# EAGLE design m1k_analog_mux-4052 (EAGLE 7.7.0)
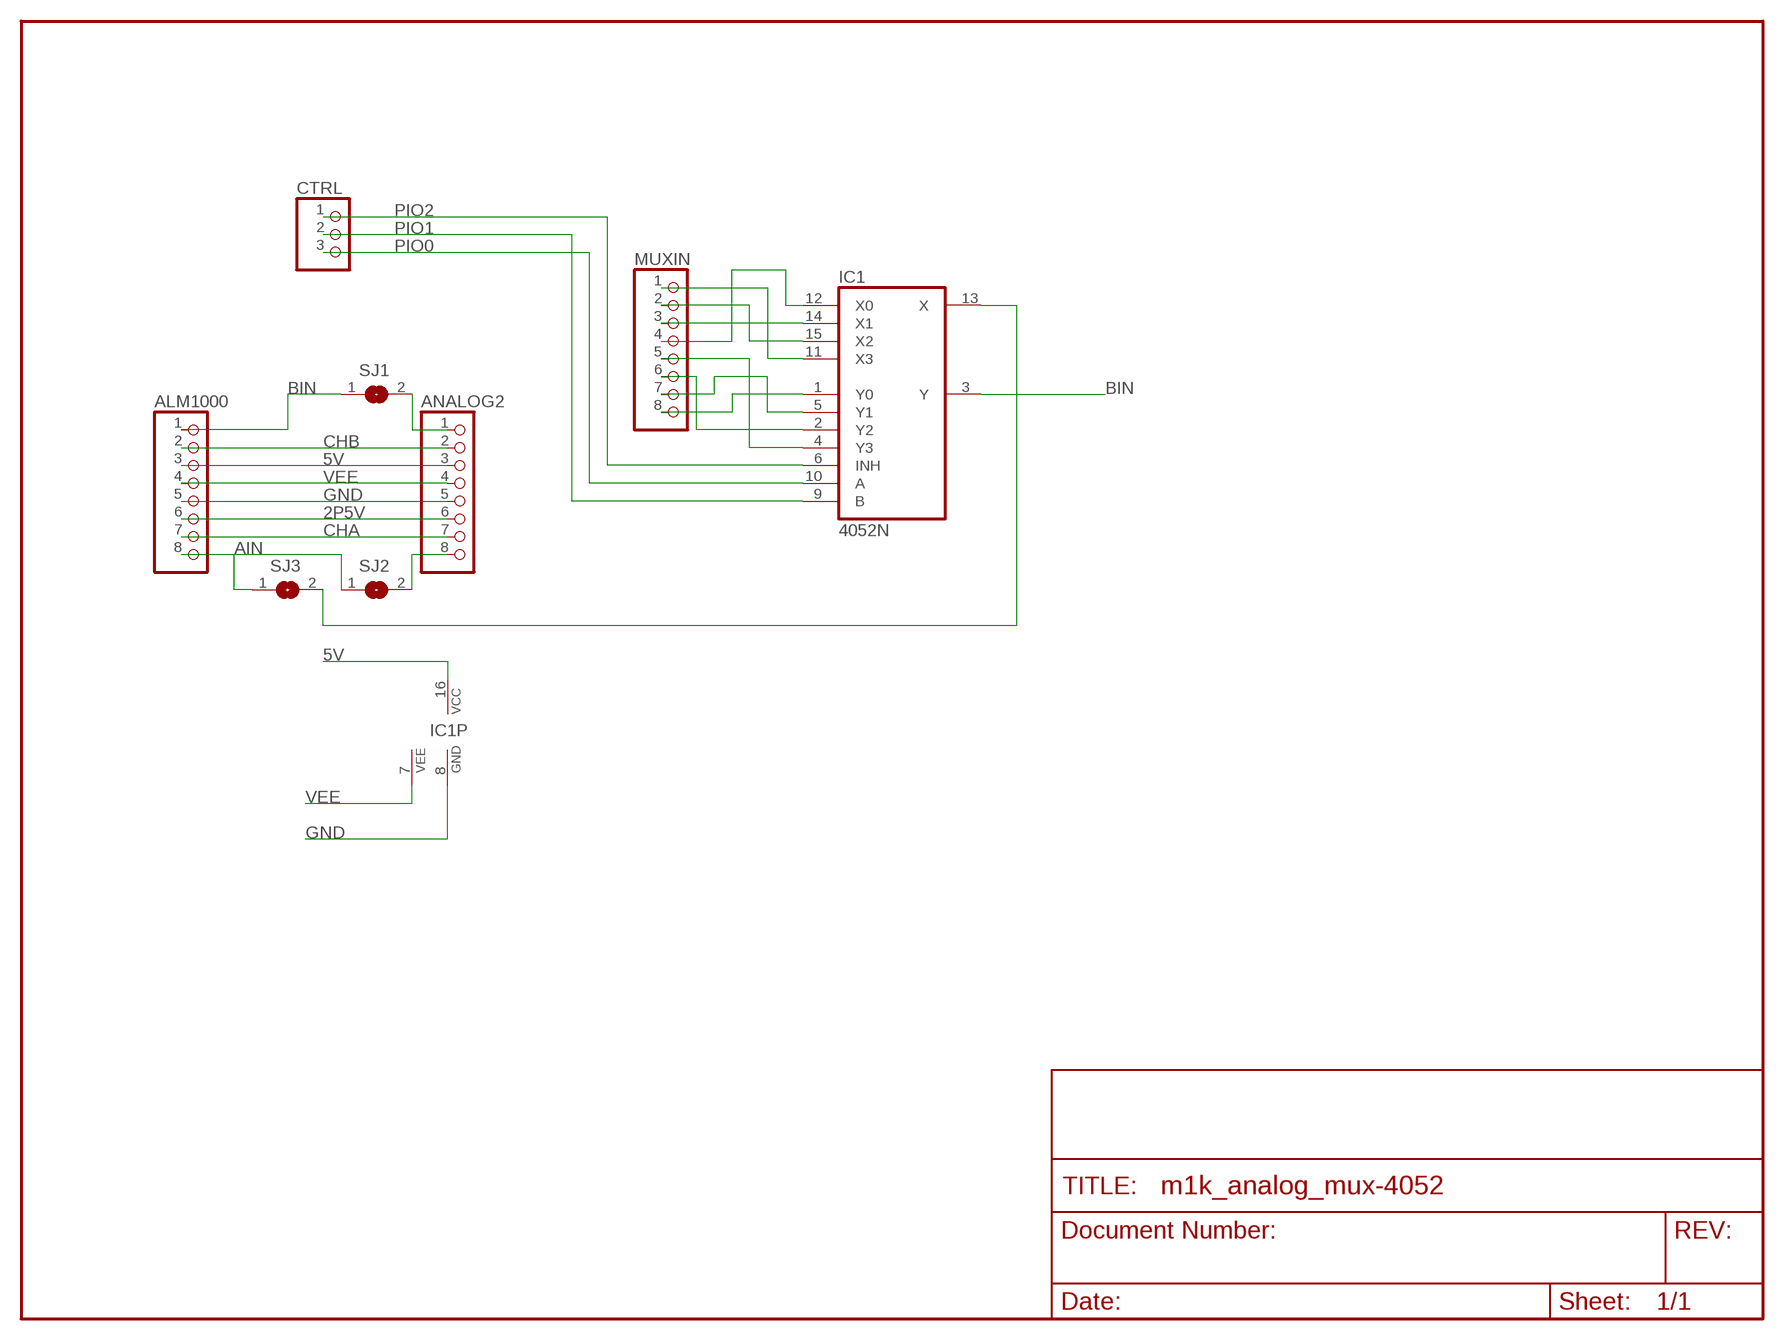
[diagram p0: schematic, sheet 1]

## Parts
ALM1000  PINHD-1X8  [1X08]
ANALOG2  PINHD-1X8  [1X08]
CTRL  PINHD-1X3  [1X03]
IC1  4052N  [DIL16]
MUXIN  PINHD-1X8  [1X08]
SJ1  SJ  [SJ]
SJ2  SJ  [SJ]
SJ3  SJ  [SJ]

## Nets
2P5V: ALM1000.6 ANALOG2.6
5V: ALM1000.3 ANALOG2.3 IC1.16(VCC)
AIN: ALM1000.8 SJ2.1 SJ3.1
BIN: ALM1000.1 IC1.3(Y) SJ1.1
CHA: ALM1000.7 ANALOG2.7
CHB: ALM1000.2 ANALOG2.2
GND: ALM1000.5 ANALOG2.5 IC1.8(GND)
N$1: IC1.1(Y0) MUXIN.8
N$2: ANALOG2.1 SJ1.2
N$3: IC1.5(Y1) MUXIN.7
N$4: IC1.2(Y2) MUXIN.6
N$5: IC1.4(Y3) MUXIN.5
N$6: IC1.11(X3) MUXIN.1
N$7: IC1.15(X2) MUXIN.2
N$8: IC1.14(X1) MUXIN.3
N$9: IC1.12(X0) MUXIN.4
N$10: ANALOG2.8 SJ2.2
N$11: IC1.13(X) SJ3.2
PIO0: CTRL.3 IC1.10(A)
PIO1: CTRL.2 IC1.9(B)
PIO2: CTRL.1 IC1.6(INH)
VEE: ALM1000.4 ANALOG2.4 IC1.7(VEE)

## Library data of the parts
ALM1000 ANALOG2 MUXIN = pinhead:PINHD-1X8: PIN HEADER
CTRL = pinhead:PINHD-1X3: PIN HEADER
IC1 = 40xx:4052: Dual 4-channel ANALOG MULTIPLEXER
SJ1-SJ3 = jumper:SJ: SMD solder JUMPER

## Board
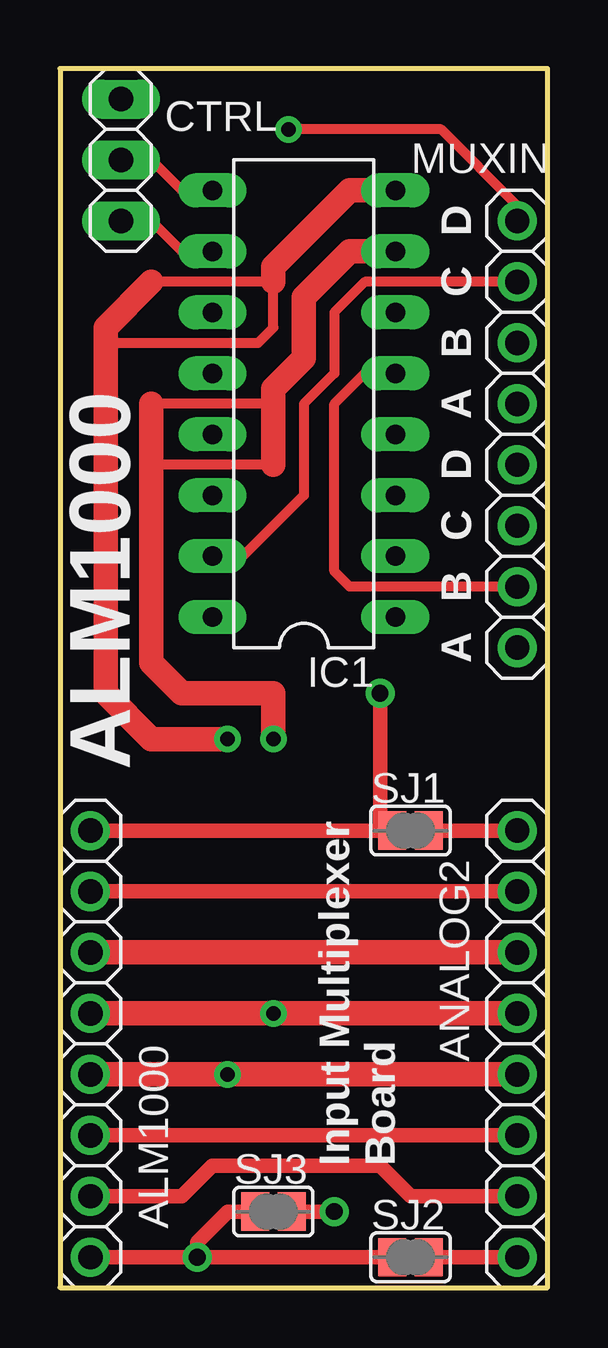
[diagram p1: board, top side]
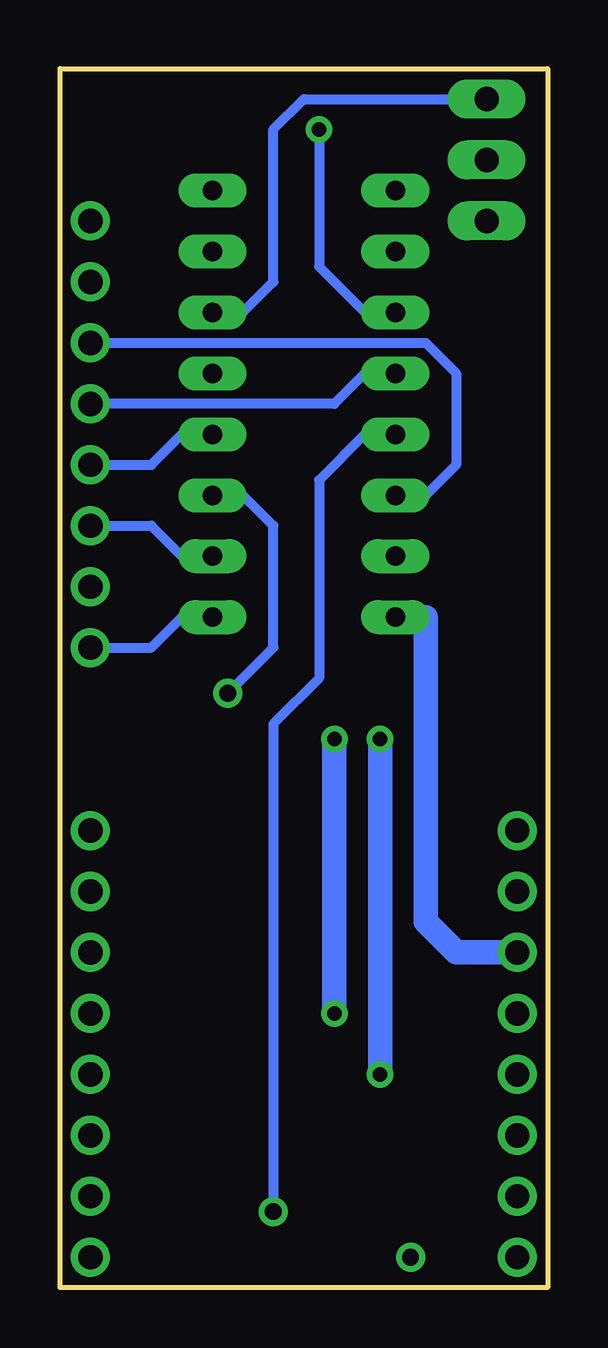
[diagram p2: board, bottom side, seen from below]

Size 20.32 x 50.8 mm. Coordinates in mm from the lower left corner, seen from the top.
Outline: 20.32,0 20.32,50.8 0,50.8 0,0 20.32,0
Copper layers (1*16): Top 0.035mm / dielectric 1.5mm / Bottom 0.035mm
Design rules "default": minimum track width 8mil, minimum drill 20mil, track to track 8mil, track to pad 8mil, pad to pad 8mil, via to via 8mil, smd to smd 8mil, copper to edge 8mil, drill to drill 8mil, minimum pad ring 12mil, minimum via ring 10mil, stop-mask expansion 4mil, vias tented up to drill 20mil, thermal gap 10mil

### Footprints (pad centres in the part's own frame; a part is rotated, then mirrored left to right if it is on the bottom)
1X08 = drill 1.016: 1 -8.89,0; 2 -6.35,0; 3 -3.81,0; 4 -1.27,0; 5 1.27,0; 6 3.81,0; 7 6.35,0; 8 8.89,0
1X03 = drill 1.016 long: 1 -2.54,0; 2 0,0; 3 2.54,0
DIL16 = drill 0.813 long: 1 -8.89,-3.81; 2 -6.35,-3.81; 3 -3.81,-3.81; 4 -1.27,-3.81; 5 1.27,-3.81; 6 3.81,-3.81; 7 6.35,-3.81; 8 8.89,-3.81; 9 8.89,3.81; 10 6.35,3.81; 11 3.81,3.81; 12 1.27,3.81; 13 -1.27,3.81; 14 -3.81,3.81; 15 -6.35,3.81; 16 -8.89,3.81
SJ = smd 1.168 x 1.6: 1 -0.762,0; 2 0.762,0

### Placement (x,y rotation side)
ALM1000  1.27,10.16 270 top
ANALOG2  19.05,10.16 270 top
CTRL  2.54,46.99 270 top
IC1  10.16,36.83 90 top
MUXIN  19.05,35.56 270 top
SJ1  14.61,19.05 0 top
SJ2  14.61,1.27 0 top
SJ3  8.89,3.17 0 top

### Tracks (layer width: path | path; a pad name or v marks a point on that pad's centre or on a via)
2P5V
  Top 0.61: ALM1000.6 ANALOG2.6
5V
  Top 1.016: ALM1000.3 ANALOG2.3
  Bottom 1.016: IC1.16 5.08,27.94 5.08,15.24 3.81,13.97 ALM1000.3
AIN  (via drill 0.7)
  Top 0.61: ALM1000.8 v5.71,1.27 | v5.71,1.27 5.71,1.91 6.99,3.17 SJ3.1 | SJ2.1 v5.71,1.27
BIN  (via drill 0.7)
  Top 0.61: ALM1000.1 13.34,19.05 | 13.34,19.05 SJ1.1 | v13.34,24.77 13.34,19.05
  Bottom 0.406: v13.34,24.77 11.43,26.67 11.43,31.75 12.7,33.02 IC1.3
CHA
  Top 0.61: ALM1000.7 5.08,3.81 6.35,5.08 13.34,5.08 14.61,3.81 ANALOG2.7
CHB
  Top 0.61: ALM1000.2 ANALOG2.2
GND  (via drill 0.6)
  Top 0.406: 3.81,41.91 8.89,41.91 8.89,40.01 8.26,39.37 1.91,39.37
  Top 1.016: IC1.8 12.06,45.72 8.89,42.55 8.89,41.91 | 3.81,41.91 1.91,40.01 1.91,39.37 1.91,24.77 3.81,22.86 v6.99,22.86 | v6.99,8.89 ALM1000.5 ANALOG2.5
  Bottom 1.016: v6.99,22.86 v6.99,8.89
N$1
  Bottom 0.406: MUXIN.8 16.51,26.67 15.24,27.94 IC1.1
N$2
  Top 0.61: ANALOG2.1 SJ1.2
N$3
  Top 0.406: MUXIN.7 12.06,29.21 11.43,29.84 11.43,36.83 12.7,38.1 IC1.5
N$4
  Bottom 0.406: MUXIN.6 16.51,31.75 15.24,30.48 IC1.2
N$5
  Bottom 0.406: MUXIN.5 16.51,34.29 15.24,35.56 IC1.4
N$6  (via drill 0.6)
  Top 0.406: MUXIN.1 19.05,45.09 15.88,48.26 v9.53,48.26
  Bottom 0.406: v9.53,48.26 9.53,42.55 7.62,40.64 IC1.11
N$7
  Top 0.406: MUXIN.2 12.7,41.91 11.43,40.64 11.43,38.1 10.16,36.83 10.16,33.02 7.62,30.48 IC1.15
N$8
  Bottom 0.406: MUXIN.3 5.08,39.37 3.81,38.1 3.81,34.29 5.08,33.02 IC1.14
N$9
  Bottom 0.406: IC1.12 7.62,38.1 8.89,36.83 MUXIN.4
N$10
  Top 0.61: ANALOG2.8 SJ2.2
N$11  (via drill 0.7)
  Top 0.61: SJ3.2 v11.43,3.17
  Bottom 0.406: IC1.13 7.62,35.56 9.53,33.66 9.53,25.4 11.43,23.5 v11.43,3.17
PIO0
  Top 0.406: CTRL.3 3.81,44.45 5.08,43.18 IC1.10
PIO1
  Top 0.406: CTRL.2 3.81,46.99 5.08,45.72 IC1.9
PIO2
  Bottom 0.406: IC1.6 12.7,40.64 11.43,41.91 11.43,48.26 10.16,49.53 CTRL.1
VEE  (via drill 0.6)
  Top 0.406: 8.89,34.29 3.81,34.29 | 8.89,36.83 3.81,36.83
  Top 1.016: IC1.7 12.06,43.18 10.16,41.27 10.16,38.73 8.89,37.47 8.89,36.83 8.89,34.29 | v8.89,22.86 8.89,24.77 5.08,24.77 3.81,26.04 3.81,34.29 3.81,36.83 | ALM1000.4 v8.89,11.43 ANALOG2.4
  Bottom 1.016: v8.89,22.86 v8.89,11.43

### Text on the board
tPlace: D | C | B | A | D | C | B | A | ALM1000 | Input Multiplexer | Board